# Altium schematic sheet MR_UartConnector.SchDoc
size A4; CompanyName: BeeIonic; SheetNumber: 7; SheetTotal: 7
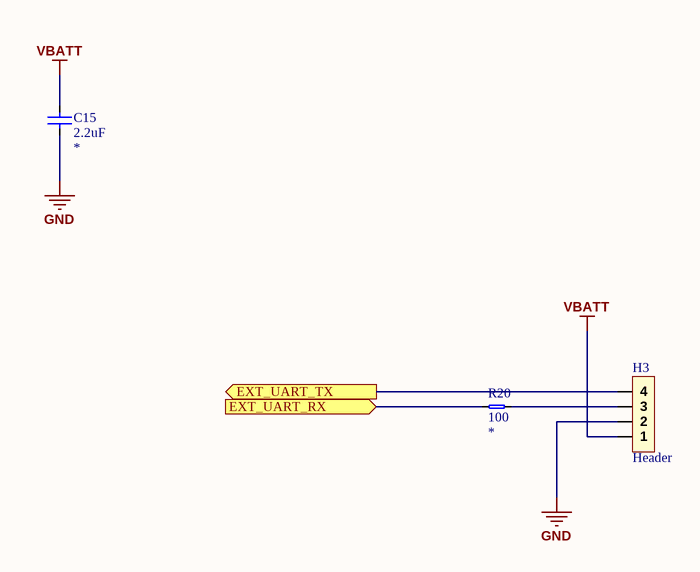
[diagram p0: MR_UartConnector.SchDoc]

## Parts
C15  value 2.2uF  [0603_CAP_LD]  (hidden comment: CerCap)
H3  Header  [HE14 1x4 Straight]
R20  value 100  [0603_RES_LD]  (hidden comment: Resistor)

## Ports
EXT_UART_RX (in), EXT_UART_TX (out)

## Nets
GND: C15.1 H3.2
VBATT: C15.2 H3.1
EXT_UART_RX: R20.1 ; port EXT_UART_RX
EXT_UART_TX: H3.4 ; port EXT_UART_TX
NetH3_3: H3.3 R20.2

## Notes on the sheet
- Project :
- Title :
- Sheet:
- of
- Creation Date :
- Designer :
- Modified Date :

## Library data of the parts
C15 = CerCap: Ceramic Capacitor; Type: *; Voltage/Power: *; Package: *
H3 = Header_4x1: Header 4x1 PIns
R20 = Resistor: Precision: *; Package: *